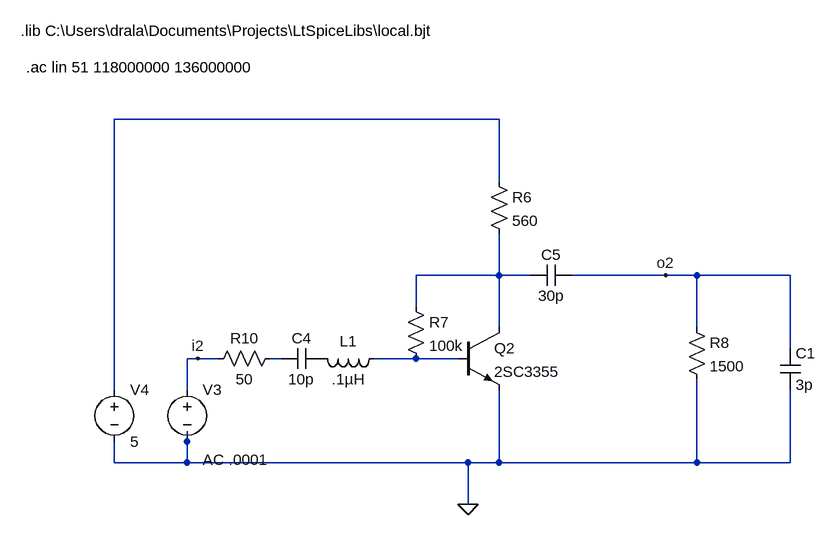
[diagram p0: schematic RF input amp.asc]
RF input amp.asc, the LTspice schematic file:
Version 4.1
SHEET 1 1620 680
WIRE 384 -272 -208 -272
WIRE 384 -176 384 -272
WIRE 384 -32 384 -96
WIRE 384 -32 256 -32
WIRE 432 -32 384 -32
WIRE 640 -32 496 -32
WIRE 688 -32 640 -32
WIRE 832 -32 688 -32
WIRE 256 16 256 -32
WIRE 384 48 384 -32
WIRE 688 48 688 -32
WIRE 832 80 832 -32
WIRE -80 96 -96 96
WIRE -48 96 -80 96
WIRE 48 96 32 96
WIRE 256 96 192 96
WIRE 320 96 256 96
WIRE -208 144 -208 -272
WIRE -96 144 -96 96
WIRE -96 224 -96 208
WIRE -208 256 -208 224
WIRE -96 256 -96 224
WIRE -96 256 -208 256
WIRE 336 256 -96 256
WIRE 384 256 384 144
WIRE 384 256 336 256
WIRE 688 256 688 128
WIRE 688 256 384 256
WIRE 832 256 832 144
WIRE 832 256 688 256
WIRE 336 320 336 256
FLAG 336 320 0
FLAG 640 -32 o2
FLAG -80 96 i2
SYMBOL npn 320 48 R0
SYMATTR InstName Q2
SYMATTR Value 2SC3355
SYMBOL voltage -96 128 R0
WINDOW 123 24 124 Left 2
WINDOW 39 24 152 Left 2
SYMATTR Value2 AC .0001
SYMATTR InstName V3
SYMATTR Value ""
SYMBOL voltage -208 128 R0
WINDOW 123 0 0 Left 0
WINDOW 39 0 0 Left 0
SYMATTR InstName V4
SYMATTR Value 5
SYMBOL res 368 -192 R0
SYMATTR InstName R6
SYMATTR Value 560
SYMBOL res 240 0 R0
SYMATTR InstName R7
SYMATTR Value 100k
SYMBOL cap 496 -48 R90
WINDOW 0 0 32 VBottom 2
WINDOW 3 32 32 VTop 2
SYMATTR InstName C5
SYMATTR Value 30p
SYMBOL res 672 32 R0
SYMATTR InstName R8
SYMATTR Value 1500
SYMBOL res 48 80 R90
WINDOW 0 0 56 VBottom 2
WINDOW 3 32 56 VTop 2
SYMATTR InstName R10
SYMATTR Value 50
SYMBOL ind 208 80 R90
WINDOW 0 5 56 VBottom 2
WINDOW 3 32 56 VTop 2
SYMATTR InstName L1
SYMATTR Value .1µH
SYMBOL cap 112 80 R90
WINDOW 0 0 32 VBottom 2
WINDOW 3 32 32 VTop 2
SYMATTR InstName C4
SYMATTR Value 10p
SYMBOL cap 816 80 R0
SYMATTR InstName C1
SYMATTR Value 3p
TEXT -344 -352 Left 2 !.ac lin 51 118000000 136000000
TEXT -352 -408 Left 2 !.lib C:\\Users\\drala\\Documents\\Projects\\LtSpiceLibs\\local.bjt

The netlist it stands for:
* RF input amp.asc
Q2 N002 N004 0 0 2SC3355
V3 i2 0 AC .0001
V4 N001 0 5
R6 N001 N002 560
R7 N002 N004 100k
C5 o2 N002 30p
R8 o2 0 1500
R10 N003 i2 50
L1 N004 P001 .1µH
C4 P001 N003 10p
C1 o2 0 3p
.model NPN NPN
.model PNP PNP
.lib standard.bjt
.ac lin 51 118000000 136000000
.lib C:\Users\drala\Documents\Projects\LtSpiceLibs\local.bjt
.backanno
.end